# Altium schematic sheet [1] TopLevel.SchDoc
size A3
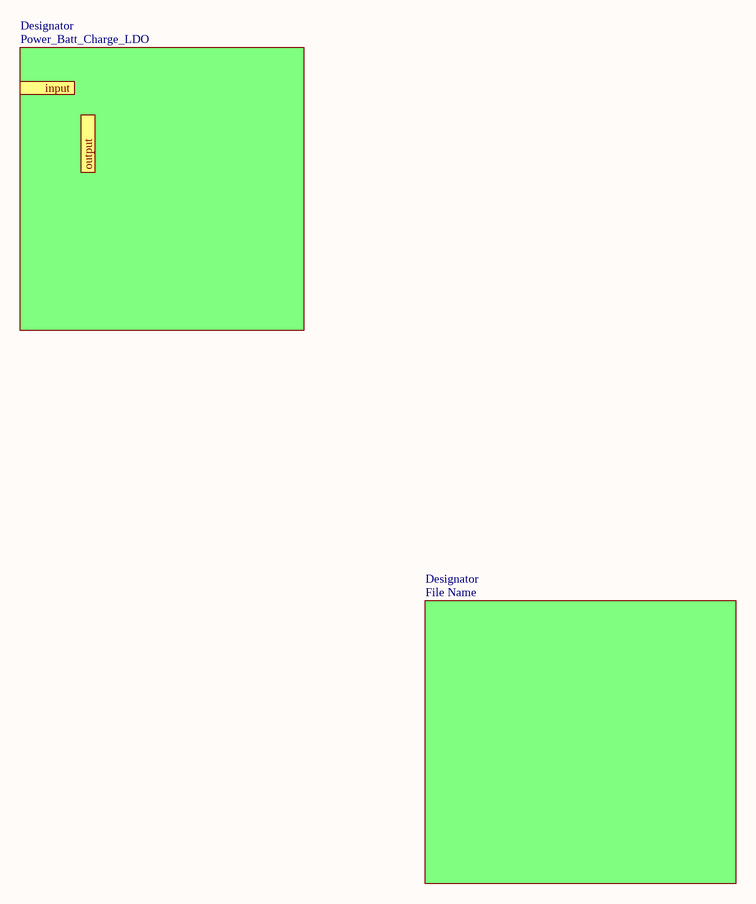
[diagram p0: [1] TopLevel.SchDoc]

## Sub-sheets
Designator = Power_Batt_Charge_LDO: no entries
Designator = File Name: no entries

## Ports
input (in), output (out)